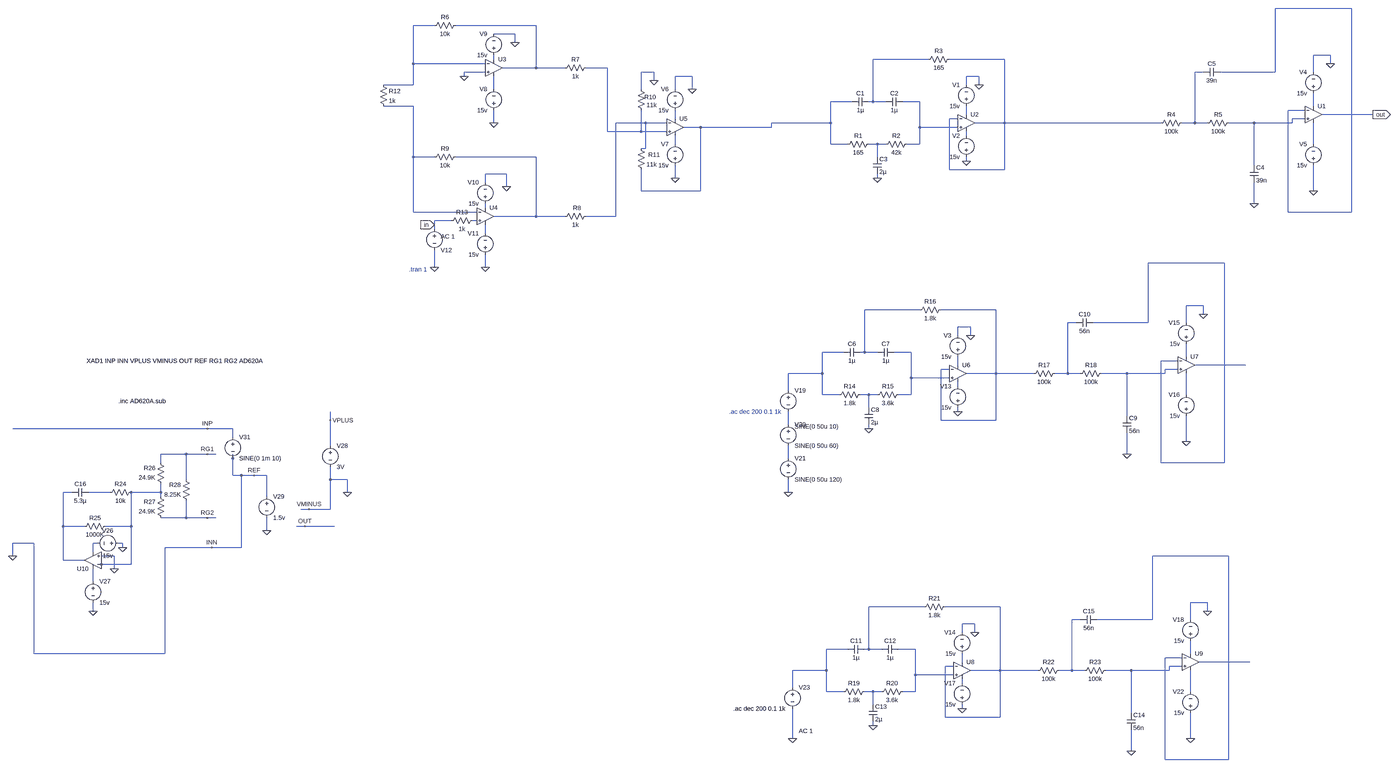
[diagram p0: schematic heart.asc, whole sheet]
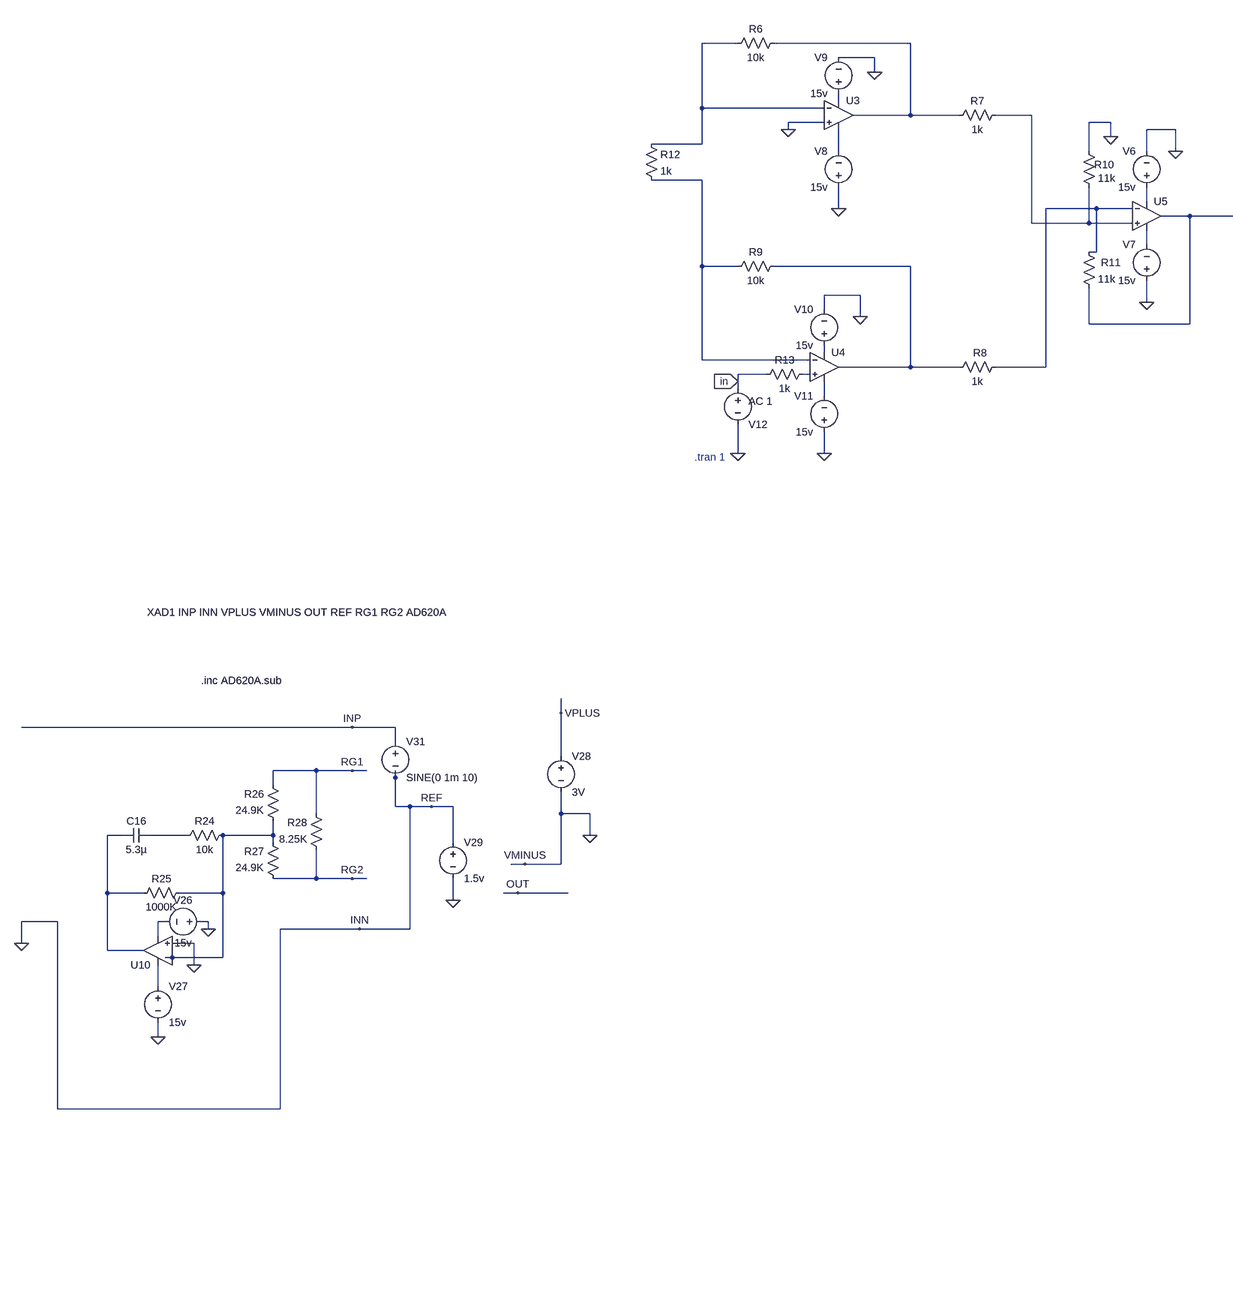
[diagram p1: schematic heart.asc, part, row 1 of 1, column 1 of 2]
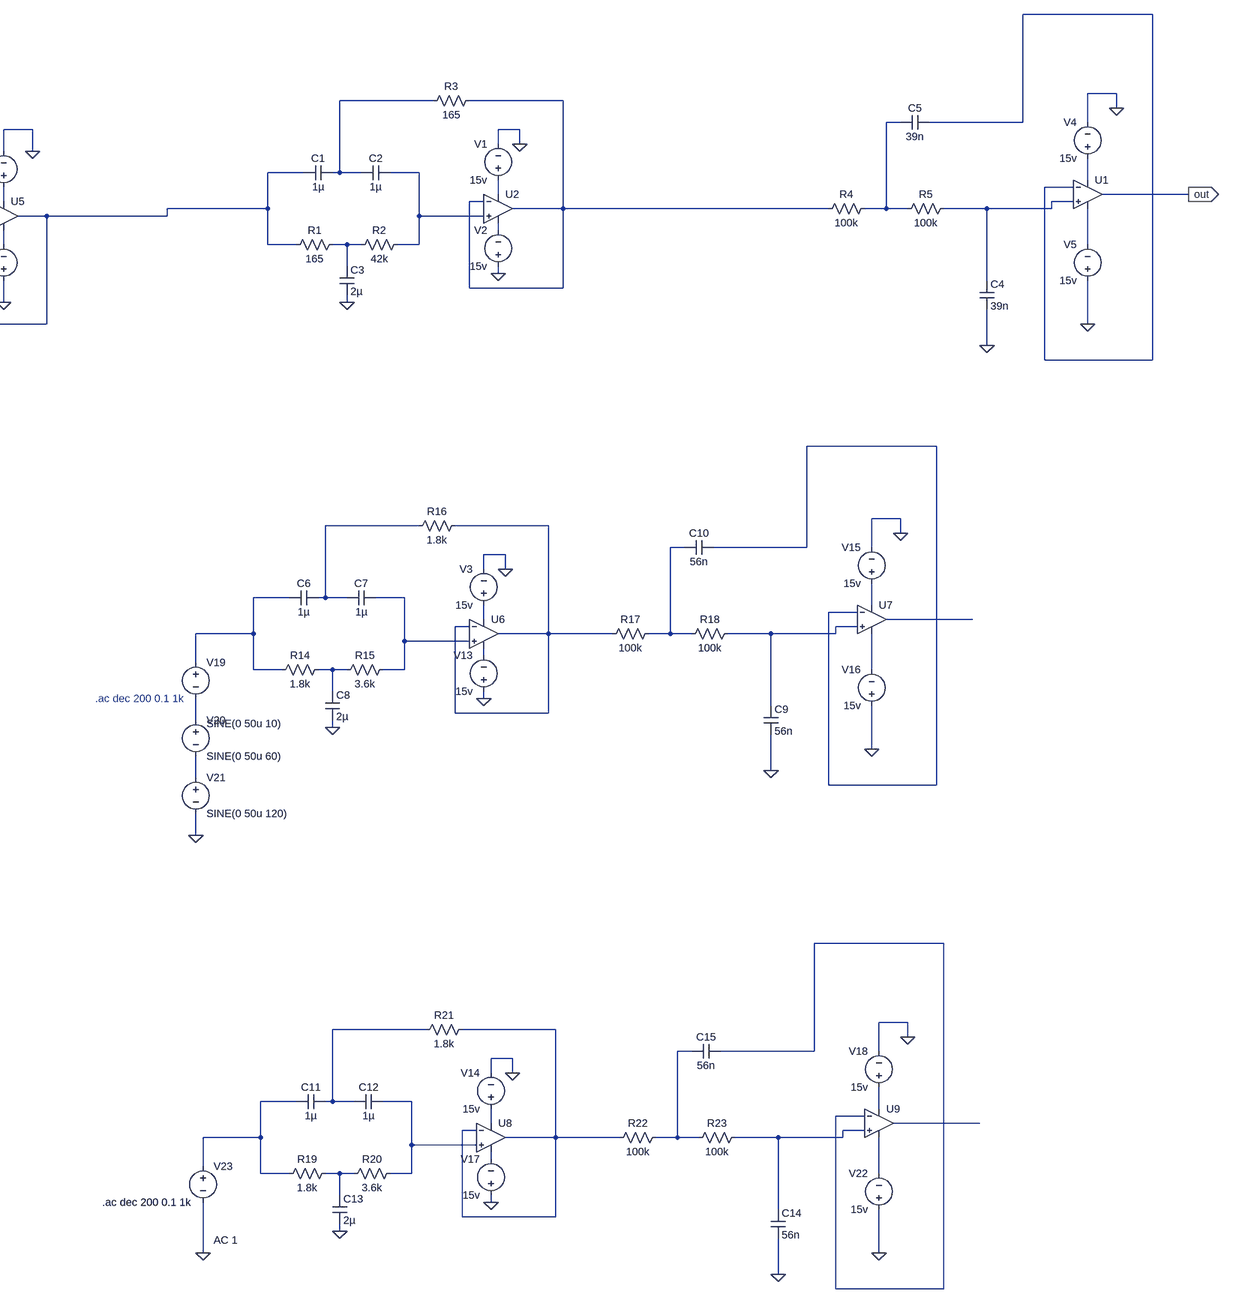
[diagram p2: schematic heart.asc, part, row 1 of 1, column 2 of 2]
heart.asc, the LTspice schematic file:
Version 4
SHEET 1 1904 2708
WIRE 1728 -320 1440 -320
WIRE -1824 -256 -1904 -256
WIRE -1440 -256 -1744 -256
WIRE -1520 -224 -1600 -224
WIRE -1520 -192 -1520 -224
WIRE 1648 -144 1584 -144
WIRE -1600 -128 -1600 -144
WIRE 128 -128 -80 -128
WIRE 416 -128 208 -128
WIRE -1904 -112 -1904 -256
WIRE -1632 -112 -1904 -112
WIRE 1648 -112 1648 -144
WIRE -1440 -96 -1440 -256
WIRE -1440 -96 -1568 -96
WIRE -1328 -96 -1440 -96
WIRE -1168 -96 -1248 -96
WIRE -1632 -80 -1712 -80
WIRE -992 -80 -1040 -80
WIRE 1168 -80 1136 -80
WIRE 1440 -80 1440 -320
WIRE 1440 -80 1232 -80
WIRE 1584 -80 1584 -144
WIRE -1712 -64 -1712 -80
WIRE -848 -64 -912 -64
WIRE 320 -64 272 -64
WIRE -992 -48 -992 -80
WIRE -1904 -32 -1904 -112
WIRE -1904 -32 -2016 -32
WIRE 272 -32 272 -64
WIRE 320 -32 320 -64
WIRE -1600 -16 -1600 -64
WIRE -1040 -16 -1040 -80
WIRE -912 -16 -912 -64
WIRE -848 -16 -848 -64
WIRE -160 32 -240 32
WIRE -80 32 -80 -128
WIRE -80 32 -96 32
WIRE -32 32 -80 32
WIRE 96 32 32 32
WIRE -1904 48 -2016 48
WIRE 1584 48 1584 0
WIRE 1552 64 1488 64
WIRE 272 80 272 48
WIRE 1808 80 1616 80
WIRE -912 96 -912 64
WIRE 240 96 208 96
WIRE 1552 96 1504 96
WIRE -1600 112 -1600 64
WIRE -1024 112 -1136 112
WIRE -944 112 -1024 112
WIRE -240 112 -240 32
WIRE -240 112 -464 112
WIRE 416 112 416 -128
WIRE 416 112 304 112
WIRE 1008 112 416 112
WIRE 1136 112 1136 -80
WIRE 1136 112 1088 112
WIRE 1184 112 1136 112
WIRE 1360 112 1264 112
WIRE 1504 112 1504 96
WIRE 1504 112 1360 112
WIRE -816 128 -880 128
WIRE -464 128 -464 112
WIRE -464 128 -816 128
WIRE 96 128 96 32
WIRE 240 128 96 128
WIRE -1168 144 -1168 -96
WIRE -1040 144 -1040 64
WIRE -1040 144 -1168 144
WIRE -944 144 -1040 144
WIRE 272 160 272 144
WIRE -912 192 -912 160
WIRE -240 192 -240 112
WIRE -176 192 -240 192
WIRE -64 192 -96 192
WIRE -32 192 -64 192
WIRE 96 192 96 128
WIRE 96 192 48 192
WIRE 1584 192 1584 112
WIRE -1024 208 -1024 112
WIRE -1024 208 -1040 208
WIRE -1904 240 -1904 48
WIRE -1824 240 -1904 240
WIRE -1440 240 -1744 240
WIRE -64 240 -64 192
WIRE 272 256 272 240
WIRE 1360 272 1360 112
WIRE 208 288 208 96
WIRE 416 288 416 112
WIRE 416 288 208 288
WIRE -1552 304 -1632 304
WIRE -912 320 -912 272
WIRE -64 320 -64 304
WIRE -1632 336 -1632 304
WIRE -1552 352 -1552 304
WIRE -1040 368 -1040 288
WIRE -816 368 -816 128
WIRE -816 368 -1040 368
WIRE 1584 368 1584 272
WIRE 1360 416 1360 336
WIRE -1632 432 -1632 416
WIRE -1904 448 -1904 240
WIRE -1664 448 -1904 448
WIRE 1488 448 1488 64
WIRE 1728 448 1728 -320
WIRE 1728 448 1488 448
WIRE -1440 464 -1440 240
WIRE -1440 464 -1600 464
WIRE -1328 464 -1440 464
WIRE -1136 464 -1136 112
WIRE -1136 464 -1248 464
WIRE -1760 480 -1824 480
WIRE -1664 480 -1680 480
WIRE -1824 496 -1824 480
WIRE -1824 512 -1824 496
WIRE -1632 528 -1632 496
WIRE 1248 640 960 640
WIRE -1824 656 -1824 592
WIRE -1632 656 -1632 608
WIRE 1168 816 1104 816
WIRE 96 832 -112 832
WIRE 384 832 176 832
WIRE 1168 848 1168 816
WIRE 688 880 656 880
WIRE 960 880 960 640
WIRE 960 880 752 880
WIRE 1104 880 1104 816
WIRE 288 896 240 896
WIRE 240 928 240 896
WIRE 288 928 288 896
WIRE -192 992 -272 992
WIRE -112 992 -112 832
WIRE -112 992 -128 992
WIRE -64 992 -112 992
WIRE 64 992 0 992
WIRE 1104 1008 1104 960
WIRE 1072 1024 1008 1024
WIRE 240 1040 240 1008
WIRE 1328 1040 1136 1040
WIRE 208 1056 176 1056
WIRE 1072 1056 1024 1056
WIRE -272 1072 -272 992
WIRE -272 1072 -400 1072
WIRE 384 1072 384 832
WIRE 384 1072 272 1072
WIRE 528 1072 384 1072
WIRE 656 1072 656 880
WIRE 656 1072 608 1072
WIRE 704 1072 656 1072
WIRE 880 1072 784 1072
WIRE 1024 1072 1024 1056
WIRE 1024 1072 880 1072
WIRE 64 1088 64 992
WIRE 208 1088 64 1088
WIRE 240 1120 240 1104
WIRE -400 1136 -400 1072
WIRE -272 1152 -272 1072
WIRE -208 1152 -272 1152
WIRE -96 1152 -128 1152
WIRE -64 1152 -96 1152
WIRE 64 1152 64 1088
WIRE 64 1152 16 1152
WIRE 1104 1152 1104 1072
WIRE -96 1200 -96 1152
WIRE 240 1216 240 1200
WIRE 880 1232 880 1072
WIRE -2432 1248 -2432 1216
WIRE 176 1248 176 1056
WIRE 384 1248 384 1072
WIRE 384 1248 176 1248
WIRE -400 1264 -400 1216
WIRE -2896 1280 -3696 1280
WIRE -2800 1280 -2896 1280
WIRE -96 1280 -96 1264
WIRE -2800 1312 -2800 1280
WIRE 1104 1328 1104 1232
WIRE -2432 1344 -2432 1248
WIRE -2976 1376 -3072 1376
WIRE -2896 1376 -2976 1376
WIRE -2864 1376 -2896 1376
WIRE 880 1376 880 1296
WIRE -2800 1392 -2800 1376
WIRE -400 1392 -400 1344
WIRE -3072 1408 -3072 1376
WIRE 1008 1408 1008 1024
WIRE 1248 1408 1248 640
WIRE 1248 1408 1008 1408
WIRE -2800 1456 -2800 1392
WIRE -2768 1456 -2800 1456
WIRE -2720 1456 -2768 1456
WIRE -2672 1456 -2720 1456
WIRE -2976 1472 -2976 1376
WIRE -2432 1472 -2432 1424
WIRE -2368 1472 -2432 1472
WIRE -3408 1520 -3440 1520
WIRE -3264 1520 -3344 1520
WIRE -3072 1520 -3072 1488
WIRE -3072 1520 -3184 1520
WIRE -2368 1520 -2368 1472
WIRE -400 1520 -400 1472
WIRE -3072 1536 -3072 1520
WIRE -2672 1536 -2672 1456
WIRE -2512 1584 -2544 1584
WIRE -2432 1584 -2432 1472
WIRE -2432 1584 -2512 1584
WIRE -2976 1616 -2976 1552
WIRE -2976 1616 -3072 1616
WIRE -2896 1616 -2976 1616
WIRE -2864 1616 -2896 1616
WIRE -3440 1648 -3440 1520
WIRE -3360 1648 -3440 1648
WIRE -3184 1648 -3184 1520
WIRE -3184 1648 -3280 1648
WIRE -2528 1648 -2560 1648
WIRE -2416 1648 -2528 1648
WIRE -2672 1664 -2672 1616
WIRE -3616 1712 -3696 1712
WIRE -3312 1712 -3328 1712
WIRE -3216 1712 -3232 1712
WIRE -3216 1728 -3216 1712
WIRE -2880 1728 -3056 1728
WIRE -2768 1728 -2768 1456
WIRE -2768 1728 -2880 1728
WIRE -3328 1744 -3328 1712
WIRE -3696 1760 -3696 1712
WIRE -3248 1760 -3296 1760
WIRE 1264 1760 976 1760
WIRE -3440 1776 -3440 1648
WIRE -3360 1776 -3440 1776
WIRE -3184 1792 -3184 1648
WIRE -3184 1792 -3296 1792
WIRE -3296 1808 -3296 1792
WIRE -3248 1808 -3248 1760
WIRE -3328 1856 -3328 1808
WIRE 1184 1936 1120 1936
WIRE 112 1952 -96 1952
WIRE 400 1952 192 1952
WIRE -3328 1968 -3328 1936
WIRE 1184 1968 1184 1936
WIRE 704 2000 672 2000
WIRE 976 2000 976 1760
WIRE 976 2000 768 2000
WIRE 1120 2000 1120 1936
WIRE 304 2016 256 2016
WIRE 256 2048 256 2016
WIRE 304 2048 304 2016
WIRE -176 2112 -256 2112
WIRE -96 2112 -96 1952
WIRE -96 2112 -112 2112
WIRE -48 2112 -96 2112
WIRE 80 2112 16 2112
WIRE -3616 2128 -3616 1712
WIRE -3056 2128 -3056 1728
WIRE -3056 2128 -3616 2128
WIRE 1120 2128 1120 2080
WIRE 1088 2144 1024 2144
WIRE 256 2160 256 2128
WIRE 1344 2160 1152 2160
WIRE 224 2176 192 2176
WIRE 1088 2176 1040 2176
WIRE -256 2192 -256 2112
WIRE -256 2192 -384 2192
WIRE 400 2192 400 1952
WIRE 400 2192 288 2192
WIRE 544 2192 400 2192
WIRE 672 2192 672 2000
WIRE 672 2192 624 2192
WIRE 720 2192 672 2192
WIRE 896 2192 800 2192
WIRE 1040 2192 1040 2176
WIRE 1040 2192 896 2192
WIRE 80 2208 80 2112
WIRE 224 2208 80 2208
WIRE 256 2240 256 2224
WIRE -384 2256 -384 2192
WIRE -256 2272 -256 2192
WIRE -192 2272 -256 2272
WIRE -80 2272 -112 2272
WIRE -48 2272 -80 2272
WIRE 80 2272 80 2208
WIRE 80 2272 32 2272
WIRE 1120 2272 1120 2192
WIRE -80 2320 -80 2272
WIRE 256 2336 256 2320
WIRE 896 2352 896 2192
WIRE 192 2368 192 2176
WIRE 400 2368 400 2192
WIRE 400 2368 192 2368
WIRE -80 2400 -80 2384
WIRE -384 2448 -384 2336
WIRE 1120 2448 1120 2352
WIRE 896 2496 896 2416
WIRE 1024 2528 1024 2144
WIRE 1264 2528 1264 1760
WIRE 1264 2528 1024 2528
FLAG 320 -32 0
FLAG 272 256 0
FLAG -64 320 0
FLAG 1584 368 0
FLAG 1648 -112 0
FLAG 1360 416 0
FLAG -912 320 0
FLAG -848 -16 0
FLAG -1632 656 0
FLAG -1552 352 0
FLAG -1600 112 0
FLAG -1520 -192 0
FLAG -1824 656 0
FLAG -992 -48 0
FLAG -1712 -64 0
FLAG -1824 496 in
IOPIN -1824 496 In
FLAG 1808 80 out
IOPIN 1808 80 Out
FLAG 288 928 0
FLAG 240 1216 0
FLAG -96 1280 0
FLAG 1104 1328 0
FLAG 1168 848 0
FLAG 880 1376 0
FLAG -400 1520 0
FLAG 304 2048 0
FLAG 256 2336 0
FLAG -80 2400 0
FLAG 1120 2448 0
FLAG 1184 1968 0
FLAG 896 2496 0
FLAG -384 2448 0
FLAG -3216 1728 0
FLAG -3328 1968 0
FLAG -3248 1808 0
FLAG -2880 1728 INN
FLAG -2432 1248 VPLUS
FLAG -2528 1648 OUT
FLAG -2896 1376 RG1
FLAG -2896 1616 RG2
FLAG -2512 1584 VMINUS
FLAG -3696 1760 0
FLAG -2896 1280 INP
FLAG -2720 1456 REF
FLAG -2672 1664 0
FLAG -2368 1520 0
SYMBOL res -80 176 R90
WINDOW 0 0 56 VBottom 2
WINDOW 3 32 56 VTop 2
SYMATTR InstName R1
SYMATTR Value 165
SYMBOL res 64 176 R90
WINDOW 0 0 56 VBottom 2
WINDOW 3 32 56 VTop 2
SYMATTR InstName R2
SYMATTR Value 42k
SYMBOL res 224 -144 R90
WINDOW 0 0 56 VBottom 2
WINDOW 3 32 56 VTop 2
SYMATTR InstName R3
SYMATTR Value 165
SYMBOL cap -96 16 R90
WINDOW 0 0 32 VBottom 2
WINDOW 3 32 32 VTop 2
SYMATTR InstName C1
SYMATTR Value 1µ
SYMBOL cap 32 16 R90
WINDOW 0 0 32 VBottom 2
WINDOW 3 32 32 VTop 2
SYMATTR InstName C2
SYMATTR Value 1µ
SYMBOL cap -80 240 R0
SYMATTR InstName C3
SYMATTR Value 2µ
SYMBOL voltage 272 64 R180
WINDOW 0 24 96 Left 2
WINDOW 3 24 16 Left 2
WINDOW 123 0 0 Left 0
WINDOW 39 0 0 Left 0
SYMATTR InstName V1
SYMATTR Value 15v
SYMBOL voltage 272 256 R180
WINDOW 0 24 96 Left 2
WINDOW 3 24 16 Left 2
WINDOW 123 0 0 Left 0
WINDOW 39 0 0 Left 0
SYMATTR InstName V2
SYMATTR Value 15v
SYMBOL OpAmps\\UniversalOpAmp2 272 112 R0
SYMATTR InstName U2
SYMBOL res 1104 96 R90
WINDOW 0 0 56 VBottom 2
WINDOW 3 32 56 VTop 2
SYMATTR InstName R4
SYMATTR Value 100k
SYMBOL res 1280 96 R90
WINDOW 0 0 56 VBottom 2
WINDOW 3 32 56 VTop 2
SYMATTR InstName R5
SYMATTR Value 100k
SYMBOL cap 1344 272 R0
SYMATTR InstName C4
SYMATTR Value 39n
SYMBOL cap 1232 -96 R90
WINDOW 0 0 32 VBottom 2
WINDOW 3 32 32 VTop 2
SYMATTR InstName C5
SYMATTR Value 39n
SYMBOL OpAmps\\UniversalOpAmp2 1584 80 R0
SYMATTR InstName U1
SYMBOL voltage 1584 16 R180
WINDOW 0 24 96 Left 2
WINDOW 3 24 16 Left 2
WINDOW 123 0 0 Left 0
WINDOW 39 0 0 Left 0
SYMATTR InstName V4
SYMATTR Value 15v
SYMBOL voltage 1584 288 R180
WINDOW 0 24 96 Left 2
WINDOW 3 24 16 Left 2
WINDOW 123 0 0 Left 0
WINDOW 39 0 0 Left 0
SYMATTR InstName V5
SYMATTR Value 15v
SYMBOL OpAmps\\UniversalOpAmp2 -1600 -96 R0
SYMATTR InstName U3
SYMBOL OpAmps\\UniversalOpAmp2 -1632 464 R0
SYMATTR InstName U4
SYMBOL OpAmps\\UniversalOpAmp2 -912 128 R0
SYMATTR InstName U5
SYMBOL res -1728 -272 R90
WINDOW 0 0 56 VBottom 2
WINDOW 3 32 56 VTop 2
SYMATTR InstName R6
SYMATTR Value 10k
SYMBOL res -1232 -112 R90
WINDOW 0 0 56 VBottom 2
WINDOW 3 32 56 VTop 2
SYMATTR InstName R7
SYMATTR Value 1k
SYMBOL res -1232 448 R90
WINDOW 0 0 50 VBottom 2
WINDOW 3 32 56 VTop 2
SYMATTR InstName R8
SYMATTR Value 1k
SYMBOL res -1728 224 R90
WINDOW 0 0 56 VBottom 2
WINDOW 3 32 56 VTop 2
SYMATTR InstName R9
SYMATTR Value 10k
SYMBOL res -1056 -32 R0
WINDOW 0 27 46 Left 2
SYMATTR InstName R10
SYMATTR Value 11k
SYMBOL res -1056 192 R0
WINDOW 0 42 40 Left 2
SYMATTR InstName R11
SYMATTR Value 11k
SYMBOL voltage -912 80 R180
WINDOW 0 24 96 Left 2
WINDOW 3 24 16 Left 2
WINDOW 123 0 0 Left 0
WINDOW 39 0 0 Left 0
SYMATTR InstName V6
SYMATTR Value 15v
SYMBOL voltage -912 288 R180
WINDOW 0 24 96 Left 2
WINDOW 3 24 16 Left 2
WINDOW 123 0 0 Left 0
WINDOW 39 0 0 Left 0
SYMATTR InstName V7
SYMATTR Value 15v
SYMBOL voltage -1600 80 R180
WINDOW 0 24 96 Left 2
WINDOW 3 24 16 Left 2
WINDOW 123 0 0 Left 0
WINDOW 39 0 0 Left 0
SYMATTR InstName V8
SYMATTR Value 15v
SYMBOL voltage -1600 -128 R180
WINDOW 0 24 96 Left 2
WINDOW 3 24 16 Left 2
WINDOW 123 0 0 Left 0
WINDOW 39 0 0 Left 0
SYMATTR InstName V9
SYMATTR Value 15v
SYMBOL voltage -1632 432 R180
WINDOW 0 24 96 Left 2
WINDOW 3 24 16 Left 2
WINDOW 123 0 0 Left 0
WINDOW 39 0 0 Left 0
SYMATTR InstName V10
SYMATTR Value 15v
SYMBOL voltage -1632 624 R180
WINDOW 0 24 96 Left 2
WINDOW 3 24 16 Left 2
WINDOW 123 0 0 Left 0
WINDOW 39 0 0 Left 0
SYMATTR InstName V11
SYMATTR Value 15v
SYMBOL voltage -1824 496 R0
WINDOW 0 24 96 Left 2
WINDOW 3 24 16 Left 2
WINDOW 123 24 44 Left 2
WINDOW 39 0 0 Left 0
SYMATTR InstName V12
SYMATTR Value ""
SYMATTR Value2 AC 1
SYMBOL res -2032 -48 R0
SYMATTR InstName R12
SYMATTR Value 1k
SYMBOL res -1664 464 R90
WINDOW 0 0 56 VBottom 2
WINDOW 3 32 56 VTop 2
SYMATTR InstName R13
SYMATTR Value 1k
SYMBOL res -112 1136 R90
WINDOW 0 0 56 VBottom 2
WINDOW 3 32 56 VTop 2
SYMATTR InstName R14
SYMATTR Value 1.8k
SYMBOL res 32 1136 R90
WINDOW 0 0 56 VBottom 2
WINDOW 3 32 56 VTop 2
SYMATTR InstName R15
SYMATTR Value 3.6k
SYMBOL res 192 816 R90
WINDOW 0 0 56 VBottom 2
WINDOW 3 32 56 VTop 2
SYMATTR InstName R16
SYMATTR Value 1.8k
SYMBOL cap -128 976 R90
WINDOW 0 0 32 VBottom 2
WINDOW 3 32 32 VTop 2
SYMATTR InstName C6
SYMATTR Value 1µ
SYMBOL cap 0 976 R90
WINDOW 0 0 32 VBottom 2
WINDOW 3 32 32 VTop 2
SYMATTR InstName C7
SYMATTR Value 1µ
SYMBOL cap -112 1200 R0
SYMATTR InstName C8
SYMATTR Value 2µ
SYMBOL voltage 240 1024 R180
WINDOW 0 24 96 Left 2
WINDOW 3 24 16 Left 2
WINDOW 123 0 0 Left 0
WINDOW 39 0 0 Left 0
SYMATTR InstName V3
SYMATTR Value 15v
SYMBOL voltage 240 1216 R180
WINDOW 0 24 96 Left 2
WINDOW 3 24 16 Left 2
WINDOW 123 0 0 Left 0
WINDOW 39 0 0 Left 0
SYMATTR InstName V13
SYMATTR Value 15v
SYMBOL OpAmps\\UniversalOpAmp2 240 1072 R0
SYMATTR InstName U6
SYMBOL res 624 1056 R90
WINDOW 0 0 56 VBottom 2
WINDOW 3 32 56 VTop 2
SYMATTR InstName R17
SYMATTR Value 100k
SYMBOL res 800 1056 R90
WINDOW 0 0 56 VBottom 2
WINDOW 3 32 56 VTop 2
SYMATTR InstName R18
SYMATTR Value 100k
SYMBOL cap 864 1232 R0
SYMATTR InstName C9
SYMATTR Value 56n
SYMBOL cap 752 864 R90
WINDOW 0 0 32 VBottom 2
WINDOW 3 32 32 VTop 2
SYMATTR InstName C10
SYMATTR Value 56n
SYMBOL OpAmps\\UniversalOpAmp2 1104 1040 R0
SYMATTR InstName U7
SYMBOL voltage 1104 976 R180
WINDOW 0 24 96 Left 2
WINDOW 3 24 16 Left 2
WINDOW 123 0 0 Left 0
WINDOW 39 0 0 Left 0
SYMATTR InstName V15
SYMATTR Value 15v
SYMBOL voltage 1104 1248 R180
WINDOW 0 24 96 Left 2
WINDOW 3 24 16 Left 2
WINDOW 123 0 0 Left 0
WINDOW 39 0 0 Left 0
SYMATTR InstName V16
SYMATTR Value 15v
SYMBOL voltage -400 1120 R0
WINDOW 3 24 152 Left 2
WINDOW 123 24 124 Left 2
WINDOW 39 0 0 Left 0
SYMATTR InstName V19
SYMATTR Value SINE(0 50u 10)
SYMBOL voltage -400 1248 R0
WINDOW 123 0 0 Left 0
WINDOW 39 0 0 Left 0
SYMATTR InstName V20
SYMATTR Value SINE(0 50u 60)
SYMBOL voltage -400 1376 R0
WINDOW 123 0 0 Left 0
WINDOW 39 0 0 Left 0
SYMATTR InstName V21
SYMATTR Value SINE(0 50u 120)
SYMBOL res -96 2256 R90
WINDOW 0 0 56 VBottom 2
WINDOW 3 32 56 VTop 2
SYMATTR InstName R19
SYMATTR Value 1.8k
SYMBOL res 48 2256 R90
WINDOW 0 0 56 VBottom 2
WINDOW 3 32 56 VTop 2
SYMATTR InstName R20
SYMATTR Value 3.6k
SYMBOL res 208 1936 R90
WINDOW 0 0 56 VBottom 2
WINDOW 3 32 56 VTop 2
SYMATTR InstName R21
SYMATTR Value 1.8k
SYMBOL cap -112 2096 R90
WINDOW 0 0 32 VBottom 2
WINDOW 3 32 32 VTop 2
SYMATTR InstName C11
SYMATTR Value 1µ
SYMBOL cap 16 2096 R90
WINDOW 0 0 32 VBottom 2
WINDOW 3 32 32 VTop 2
SYMATTR InstName C12
SYMATTR Value 1µ
SYMBOL cap -96 2320 R0
SYMATTR InstName C13
SYMATTR Value 2µ
SYMBOL voltage 256 2144 R180
WINDOW 0 24 96 Left 2
WINDOW 3 24 16 Left 2
WINDOW 123 0 0 Left 0
WINDOW 39 0 0 Left 0
SYMATTR InstName V14
SYMATTR Value 15v
SYMBOL voltage 256 2336 R180
WINDOW 0 24 96 Left 2
WINDOW 3 24 16 Left 2
WINDOW 123 0 0 Left 0
WINDOW 39 0 0 Left 0
SYMATTR InstName V17
SYMATTR Value 15v
SYMBOL OpAmps\\UniversalOpAmp2 256 2192 R0
SYMATTR InstName U8
SYMBOL res 640 2176 R90
WINDOW 0 0 56 VBottom 2
WINDOW 3 32 56 VTop 2
SYMATTR InstName R22
SYMATTR Value 100k
SYMBOL res 816 2176 R90
WINDOW 0 0 56 VBottom 2
WINDOW 3 32 56 VTop 2
SYMATTR InstName R23
SYMATTR Value 100k
SYMBOL cap 880 2352 R0
SYMATTR InstName C14
SYMATTR Value 56n
SYMBOL cap 768 1984 R90
WINDOW 0 0 32 VBottom 2
WINDOW 3 32 32 VTop 2
SYMATTR InstName C15
SYMATTR Value 56n
SYMBOL OpAmps\\UniversalOpAmp2 1120 2160 R0
SYMATTR InstName U9
SYMBOL voltage 1120 2096 R180
WINDOW 0 24 96 Left 2
WINDOW 3 24 16 Left 2
WINDOW 123 0 0 Left 0
WINDOW 39 0 0 Left 0
SYMATTR InstName V18
SYMATTR Value 15v
SYMBOL voltage 1120 2368 R180
WINDOW 0 24 96 Left 2
WINDOW 3 24 16 Left 2
WINDOW 123 0 0 Left 0
WINDOW 39 0 0 Left 0
SYMATTR InstName V22
SYMATTR Value 15v
SYMBOL voltage -384 2240 R0
WINDOW 3 24 152 Left 2
WINDOW 123 24 180 Left 2
WINDOW 39 0 0 Left 0
SYMATTR InstName V23
SYMATTR Value ""
SYMATTR Value2 AC 1
SYMBOL cap -3344 1504 R90
WINDOW 0 0 32 VBottom 2
WINDOW 3 32 32 VTop 2
SYMATTR InstName C16
SYMATTR Value 5.3µ
SYMBOL res -3168 1504 R90
WINDOW 0 0 56 VBottom 2
WINDOW 3 32 56 VTop 2
SYMATTR InstName R24
SYMATTR Value 10k
SYMBOL res -3264 1632 R90
WINDOW 0 0 56 VBottom 2
WINDOW 3 32 56 VTop 2
SYMATTR InstName R25
SYMATTR Value 1000K
SYMBOL res -3056 1504 R180
WINDOW 0 36 76 Left 2
WINDOW 3 36 40 Left 2
SYMATTR InstName R26
SYMATTR Value 24.9K
SYMBOL res -3056 1632 R180
WINDOW 0 36 76 Left 2
WINDOW 3 36 40 Left 2
SYMATTR InstName R27
SYMATTR Value 24.9K
SYMBOL res -2960 1568 R180
WINDOW 0 36 76 Left 2
WINDOW 3 36 40 Left 2
SYMATTR InstName R28
SYMATTR Value 8.25K
SYMBOL OpAmps\\UniversalOpAmp2 -3328 1776 R180
SYMATTR InstName U10
SYMATTR Value2 Avol=1Meg GBW=1Meg Slew=500k
SYMBOL voltage -3216 1712 R90
WINDOW 0 -32 56 VBottom 2
WINDOW 3 32 56 VTop 2
WINDOW 123 0 0 Left 0
WINDOW 39 0 0 Left 0
SYMATTR InstName V26
SYMATTR Value 15v
SYMBOL voltage -3328 1840 R0
WINDOW 123 0 0 Left 0
WINDOW 39 0 0 Left 0
SYMATTR InstName V27
SYMATTR Value 15v
SYMBOL voltage -2432 1328 R0
WINDOW 123 0 0 Left 0
WINDOW 39 0 0 Left 0
SYMATTR InstName V28
SYMATTR Value 3V
SYMBOL voltage -2672 1520 R0
WINDOW 123 0 0 Left 0
WINDOW 39 0 0 Left 0
SYMATTR InstName V29
SYMATTR Value 1.5v
SYMBOL voltage -2800 1296 R0
WINDOW 123 0 0 Left 0
WINDOW 39 0 0 Left 0
SYMATTR InstName V31
SYMATTR Value SINE(0 1m 10)
TEXT -1920 664 Left 2 ;.tran 1
TEXT -624 1216 Left 2 ;.ac dec 200 0.1 1k
TEXT -608 2336 Left 2 !.ac dec 200 0.1 1k
TEXT -3352 1024 Left 2 !XAD1 INP INN VPLUS VMINUS OUT REF RG1 RG2 AD620A
TEXT -3232 1176 Left 2 !.inc AD620A.sub

The netlist it stands for:
* heart.asc
R1 N020 N010 165
R2 N011 N020 42k
R3 N006 N005 165
C1 N005 N010 1µ
C2 N011 N005 1µ
C3 N020 0 2µ
V1 N014 0 15v
V2 0 N018 15v
XU2 N011 N006 N014 N018 N006 level2 Avol=1Meg GBW=10Meg Slew=10Meg Ilimit=25m Rail=0 Vos=0 En=0 Enk=0 In=0 Ink=0 Rin=500Meg  ; pins In+ In- V+ V- OUT
R4 N008 N006 100k
R5 N016 N008 100k
C4 N016 0 39n
C5 N001 N008 39n
XU1 N016 N001 N013 N021 out level2 Avol=1Meg GBW=10Meg Slew=10Meg Ilimit=25m Rail=0 Vos=0 En=0 Enk=0 In=0 Ink=0 Rin=500Meg  ; pins In+ In- V+ V- OUT
V4 N013 0 15v
V5 0 N021 15v
XU3 0 N002 N004 N009 N003 level2 Avol=1Meg GBW=10Meg Slew=10Meg Ilimit=25m Rail=0 Vos=0 En=0 Enk=0 In=0 Ink=0 Rin=500Meg  ; pins In+ In- V+ V- OUT
XU4 N024 N012 N023 N025 N022 level2 Avol=1Meg GBW=10Meg Slew=10Meg Ilimit=25m Rail=0 Vos=0 En=0 Enk=0 In=0 Ink=0 Rin=500Meg  ; pins In+ In- V+ V- OUT
XU5 N007 N017 N015 N019 N010 level2 Avol=1Meg GBW=10Meg Slew=10Meg Ilimit=25m Rail=0 Vos=0 En=0 Enk=0 In=0 Ink=0 Rin=500Meg  ; pins In+ In- V+ V- OUT
R6 N003 N002 10k
R7 N007 N003 1k
R8 N017 N022 1k
R9 N022 N012 10k
R10 0 N007 11k
R11 N017 N010 11k
V6 N015 0 15v
V7 0 N019 15v
V8 0 N009 15v
V9 N004 0 15v
V10 N023 0 15v
V11 0 N025 15v
V12 in 0 AC 1
R12 N002 N012 1k
R13 N024 in 1k
R14 N037 N030 1.8k
R15 N031 N037 3.6k
R16 N028 N027 1.8k
C6 N027 N030 1µ
C7 N031 N027 1µ
C8 N037 0 2µ
V3 N033 0 15v
V13 0 N036 15v
XU6 N031 N028 N033 N036 N028 level2 Avol=1Meg GBW=10Meg Slew=10Meg Ilimit=25m Rail=0 Vos=0 En=0 Enk=0 In=0 Ink=0 Rin=500Meg  ; pins In+ In- V+ V- OUT
R17 N029 N028 100k
R18 N035 N029 100k
C9 N035 0 56n
C10 N026 N029 56n
XU7 N035 N026 N032 N038 N034 level2 Avol=1Meg GBW=10Meg Slew=10Meg Ilimit=25m Rail=0 Vos=0 En=0 Enk=0 In=0 Ink=0 Rin=500Meg  ; pins In+ In- V+ V- OUT
V15 N032 0 15v
V16 0 N038 15v
V19 N030 N039 SINE(0 50u 10)
V20 N039 N040 SINE(0 50u 60)
V21 N040 0 SINE(0 50u 120)
R19 N057 N050 1.8k
R20 N051 N057 3.6k
R21 N048 N047 1.8k
C11 N047 N050 1µ
C12 N051 N047 1µ
C13 N057 0 2µ
V14 N053 0 15v
V17 0 N056 15v
XU8 N051 N048 N053 N056 N048 level2 Avol=1Meg GBW=10Meg Slew=10Meg Ilimit=25m Rail=0 Vos=0 En=0 Enk=0 In=0 Ink=0 Rin=500Meg  ; pins In+ In- V+ V- OUT
R22 N049 N048 100k
R23 N055 N049 100k
C14 N055 0 56n
C15 N045 N049 56n
XU9 N055 N045 N052 N058 N054 level2 Avol=1Meg GBW=10Meg Slew=10Meg Ilimit=25m Rail=0 Vos=0 En=0 Enk=0 In=0 Ink=0 Rin=500Meg  ; pins In+ In- V+ V- OUT
V18 N052 0 15v
V22 0 N058 15v
V23 N050 0 AC 1
C16 N042 N041 5.3µ
R24 N043 N042 10k
R25 N043 N041 1000K
R26 N043 RG1 24.9K
R27 RG2 N043 24.9K
R28 RG2 RG1 8.25K
XU10 0 N043 N046 N044 N041 level2 Avol=1Meg GBW=1Meg Slew=500k Ilimit=25m Rail=0 Vos=0 En=0 Enk=0 In=0 Ink=0 Rin=500Meg  ; pins In+ In- V+ V- OUT
V26 0 N044 15v
V27 N046 0 15v
V28 VPLUS 0 3V
V29 0 0 1.5v
V31 INP 0 SINE(0 1m 10)
* .tran 1
* .ac dec 200 0.1 1k
.ac dec 200 0.1 1k
XAD1 INP INN VPLUS VMINUS OUT REF RG1 RG2 AD620A
.inc AD620A.sub
.lib UniversalOpAmp2.lib
.backanno
.end